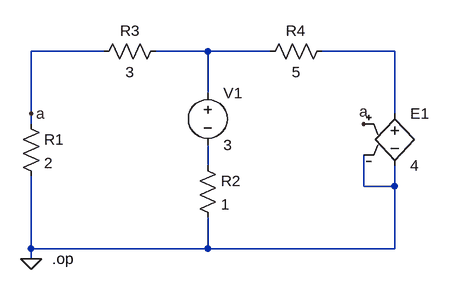
[diagram p0: schematic CH03-KP2-14.asc]
CH03-KP2-14.asc, the LTspice schematic file:
Version 4
SHEET 1 880 680
WIRE 144 208 32 208
WIRE 304 208 224 208
WIRE 400 208 304 208
WIRE 592 208 480 208
WIRE 304 272 304 208
WIRE 32 304 32 208
WIRE 592 304 592 208
WIRE 32 320 32 304
WIRE 304 384 304 352
WIRE 544 416 544 368
WIRE 592 416 592 384
WIRE 592 416 544 416
WIRE 32 512 32 400
WIRE 304 512 304 464
WIRE 304 512 32 512
WIRE 592 512 592 416
WIRE 592 512 304 512
WIRE 32 528 32 512
FLAG 32 528 0
FLAG 32 304 a
FLAG 544 320 a
DATAFLAG 32 208 "$"
SYMBOL res 16 304 R0
SYMATTR InstName R1
SYMATTR Value 2
SYMBOL res 288 368 R0
SYMATTR InstName R2
SYMATTR Value 1
SYMBOL res 240 192 R90
WINDOW 0 0 56 VBottom 2
WINDOW 3 32 56 VTop 2
SYMATTR InstName R3
SYMATTR Value 3
SYMBOL res 496 192 R90
WINDOW 0 0 56 VBottom 2
WINDOW 3 32 56 VTop 2
SYMATTR InstName R4
SYMATTR Value 5
SYMBOL voltage 304 256 R0
SYMATTR InstName V1
SYMATTR Value 3
SYMBOL e 592 288 R0
SYMATTR InstName E1
SYMATTR Value 4
TEXT 64 528 Left 2 !.op

The netlist it stands for:
* CH03-KP2-14.asc
R1 a 0 2
R2 N003 0 1
R3 N001 a 3
R4 N002 N001 5
V1 N001 N003 3
E1 N002 0 a 0 4
.op
.backanno
.end